# EAGLE design Growbox2 (EAGLE 7.7.0)
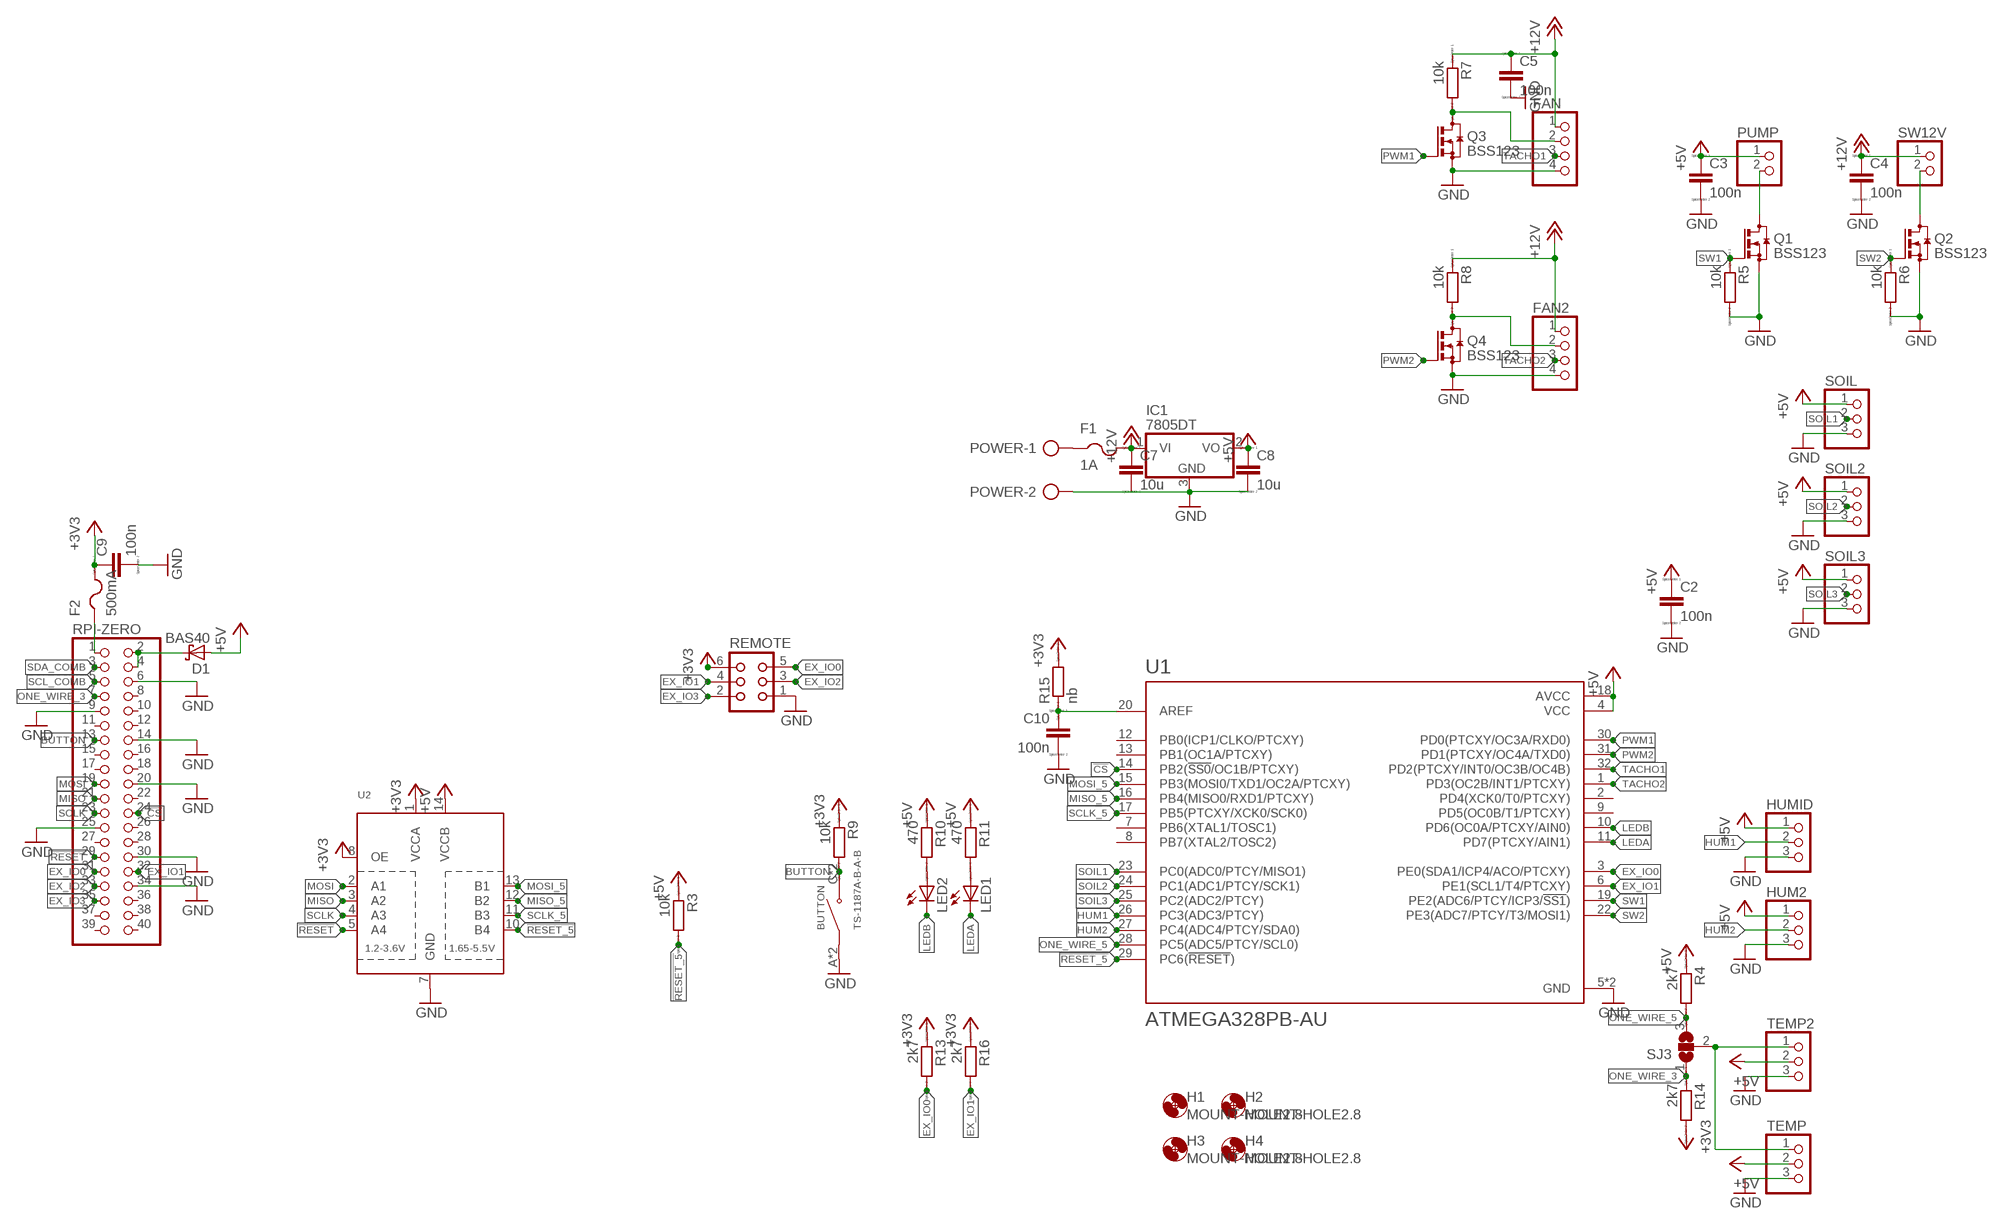
[diagram p0: schematic, sheet 1]

## Parts
BUTTON  TS-1187A-B-A-B  [SW_TS-1187A-B-A-B]
C2  100n  CC0603  [C0603]
C3  100n  CC0603  [C0603]
C4  100n  CC0603  [C0603]
C5  100n  CC0603  [C0603]
C7  10u  CC0603  [C0603]
C8  10u  CC0603  [C0603]
C9  100n  CC0603  [C0603]
C10  100n  CC0603  [C0603]
D1  BAS40  [SOT23]
F1  1A  PTCFUSE-1206  [R1206]
F2  500mA  PTCFUSE-1206  [R1206]
FAN  PINHD-1X4  [1X04]
FAN2  PINHD-1X4  [1X04]
H1  MOUNT-HOLE2.8  [2,8]
H2  MOUNT-HOLE2.8  [2,8]
H3  MOUNT-HOLE2.8  [2,8]
H4  MOUNT-HOLE2.8  [2,8]
HUM2  PINHD-1X3  [1X03]
HUMID  PINHD-1X3  [1X03]
IC1  7805DT  [TO252]
LED1  LEDCHIP-LED0603  [CHIP-LED0603]
LED2  LEDCHIP-LED0603  [CHIP-LED0603]
POWER  AK300/2  [AK300/2]
PUMP  PINHD-1X2  [1X02]
Q1  BSS123  [SOT23]
Q2  BSS123  [SOT23]
Q3  BSS123  [SOT23]
Q4  BSS123  [SOT23]
R3  10k  RR0603  [R0603]
R4  2k7  RR0603  [R0603]
R5  10k  RR0603  [R0603]
R6  10k  RR0603  [R0603]
R7  10k  RR0603  [R0603]
R8  10k  RR0603  [R0603]
R9  10k  RR0603  [R0603]
R10  470  RR0603  [R0603]
R11  470  RR0603  [R0603]
R13  2k7  RR0603  [R0603]
R14  2k7  RR0603  [R0603]
R15  nb  RR0603  [R0603]
R16  2k7  RR0603  [R0603]
REMOTE  CON06  [CON06]
RPI-ZERO  PINHD-2X20  [2X20]
SJ3  SJ2W  [SJ_2]
SOIL  PINHD-1X3  [1X03]
SOIL2  PINHD-1X3  [1X03]
SOIL3  PINHD-1X3  [1X03]
SW12V  PINHD-1X2  [1X02]
TEMP  PINHD-1X3  [1X03]
TEMP2  PINHD-1X3  [1X03]
U1  ATMEGA328PB-AU  [QFP80P900X900X120-32N]
U2  TXB0104PWR  [TSSOP14]

## Nets
!CS: RPI-ZERO.24 U1.14(PB2(!SS0!/OC1B/PTCXY))
!RESET: RPI-ZERO.29 U2.5(A4)
!RESET_5: R3.2 U1.29(PC6(!RESET!)) U2.10(B4)
+3V3: C9.1 F2.2 R9.1 R13.1 R14.2 R15.2 R16.1 REMOTE.6 U2.1(VCCA) U2.8(OE)
+5V: C2.1 C3.1 C8.1 D1.1(A) HUM2.1 HUMID.1 IC1.2(VO) PUMP.1 R3.1 R4.1 R10.1 R11.1 SOIL2.1 SOIL3.1 SOIL.1 TEMP2.2 TEMP.2 U1.4(VCC) U1.18(AVCC) U2.14(VCCB)
+12V [supply]: C4.1 C5.1 C7.1 F1.2 FAN2.1 FAN.1 IC1.1(VI) R7.1 R8.1 SW12V.1
AREF: C10.1 R15.1 U1.20(AREF)
BUTTON: BUTTON.C(NO) BUTTON.D(NO) R9.2 RPI-ZERO.13
EX_IO0: R13.2 REMOTE.5 RPI-ZERO.31 U1.3(PE0(SDA1/ICP4/ACO/PTCXY))
EX_IO1: R16.2 REMOTE.4 RPI-ZERO.32 U1.6(PE1(SCL1/T4/PTCXY))
EX_IO2: REMOTE.3 RPI-ZERO.33
EX_IO3: REMOTE.2 RPI-ZERO.35
GND [supply]: BUTTON.A(COM) BUTTON.B(COM) C2.2 C3.2 C4.2 C5.2 C7.2 C8.2 C9.2 C10.2 FAN2.4 FAN.4 HUM2.3 HUMID.3 IC1.3(GND) POWER.2 Q1.2(S) Q2.2(S) Q3.2(S) Q4.2(S) R5.2 R6.2 REMOTE.1 RPI-ZERO.6 RPI-ZERO.9 RPI-ZERO.14 RPI-ZERO.20 RPI-ZERO.25 RPI-ZERO.30 RPI-ZERO.34 SOIL2.3 SOIL3.3 SOIL.3 TEMP2.3 TEMP.3 U1.5(GND) U1.21(GND) U2.7(GND)
HUM1: HUMID.2 U1.26(PC3(ADC3/PTCY))
HUM2: HUM2.2 U1.27(PC4(ADC4/PTCY/SDA0))
LEDA: LED1.C U1.11(PD7(PTCXY/AIN1))
LEDB: LED2.C U1.10(PD6(OC0A/PTCXY/AIN0))
MISO: RPI-ZERO.21 U2.3(A2)
MISO_5: U1.16(PB4(MISO0/RXD1/PTCXY)) U2.12(B2)
MOSI: RPI-ZERO.19 U2.2(A1)
MOSI_5: U1.15(PB3(MOSI0/TXD1/OC2A/PTCXY)) U2.13(B1)
N$1: F1.1 POWER.1
N$4: F2.1 RPI-ZERO.1
N$9: LED2.A R10.2
N$10: D1.3(C) RPI-ZERO.2 RPI-ZERO.4
N$11: LED1.A R11.2
ONE_WIRE: SJ3.2 TEMP2.1 TEMP.1
ONE_WIRE_3: R14.1 RPI-ZERO.7 SJ3.1
ONE_WIRE_5: R4.2 SJ3.3 U1.28(PC5(ADC5/PTCY/SCL0))
PWM1: Q3.1(G) U1.30(PD0(PTCXY/OC3A/RXD0))
PWM1_SIG: FAN.2 Q3.3(D) R7.2
PWM2: Q4.1(G) U1.31(PD1(PTCXY/OC4A/TXD0))
PWM2_SIG: FAN2.2 Q4.3(D) R8.2
SCL_COMB: RPI-ZERO.5
SCLK: RPI-ZERO.23 U2.4(A3)
SCLK_5: U1.17(PB5(PTCXY/XCK0/SCK0)) U2.11(B3)
SDA_COMB: RPI-ZERO.3
SOIL1: SOIL.2 U1.23(PC0(ADC0/PTCY/MISO1))
SOIL2: SOIL2.2 U1.24(PC1(ADC1/PTCY/SCK1))
SOIL3: SOIL3.2 U1.25(PC2(ADC2/PTCY))
SW1: Q1.1(G) R5.1 U1.19(PE2(ADC6/PTCY/ICP3/!SS1!))
SW1_NEG: PUMP.2 Q1.3(D)
SW2: Q2.1(G) R6.1 U1.22(PE3(ADC7/PTCY/T3/MOSI1))
SW2_NEG: Q2.3(D) SW12V.2
TACHO1: FAN.3 U1.32(PD2(PTCXY/INT0/OC3B/OC4B))
TACHO2: FAN2.3 U1.1(PD3(OC2B/INT1/PTCXY))
Unconnected: RPI-ZERO.8 RPI-ZERO.10 RPI-ZERO.11 RPI-ZERO.12 RPI-ZERO.15 RPI-ZERO.16 RPI-ZERO.17 RPI-ZERO.18 RPI-ZERO.22 RPI-ZERO.26 RPI-ZERO.27 RPI-ZERO.28 RPI-ZERO.36 RPI-ZERO.37 RPI-ZERO.38 RPI-ZERO.39 RPI-ZERO.40 U1.2(PD4(XCK0/T0/PTCXY)) U1.7(PB6(XTAL1/TOSC1)) U1.8(PB7(XTAL2/TOSC2)) U1.9(PD5(OC0B/T1/PTCXY)) U1.12(PB0(ICP1/CLKO/PTCXY)) U1.13(PB1(OC1A/PTCXY))

## Library data of the parts
BUTTON = TS-1187A-B-A-B:TS-1187A-B-A-B: SPST 50mA @ 12VDC Top Actuated Round Button 160gf SMD Tactile Switches RoHS Check availability <https://pricing.snapeda.com/parts/TS-1187A-B-A-B/XKB%20Industrial%20Precision/view-part?ref=eda>; AVAILABILITY: Not in stock; CHECK_PRICES: https://www.snapeda.com/parts/TS-1187A-B-A-B/XKB+Industrial+Precision/view-part/?ref=eda; DESCRIPTION: TS-1187A-B-A-B XKB Connectivity; MF: XKB Industrial Precision; MP: TS-1187A-B-A-B; PACKAGE: Package; PRICE: None; SNAPEDA_LINK: https://www.snapeda.com/parts/TS-1187A-B-A-B/XKB+Industrial+Precision/view-part/?ref=snap
C2-C5 C7-C10 = eagle-ltspice:C: CAPACITOR, European symbol; SPICEMODEL: NONE; SPICEPREFIX: C
D1 = diode:BAS40: Silicon Schottky Diodes General-purpose diode for high-speed switching
F1 F2 = adafruit:PTCFUSE: PTC fuses, resettable thermistors
FAN FAN2 = pinhead:PINHD-1X4: PIN HEADER
H1-H4 = holes:MOUNT-HOLE: MOUNTING HOLE with drill center marker
HUM2 HUMID SOIL SOIL2 SOIL3 TEMP TEMP2 = pinhead:PINHD-1X3: PIN HEADER
IC1 = linear:78*: Positive VOLTAGE REGULATOR Source: http://cache.national.com/ds/LM/LM78L05.pdf http://www.fairchildsemi.com/ds/LM/LM7805.pdf
LED1 LED2 = adafruit:LED: LED OSRAM: - CHIPLED LG R971, LG N971, LY N971, LG Q971, LY Q971, LO R971, LY R971 LH N974, LH R974 LS Q976, LO Q976, LY Q976 LO Q996 - Hyper CHIPLED LW Q18S LB Q993, LB Q99A, LB R99A - SideLED LS A670, LO A670, LY A670, LG A670, LP A670 LB A673, LV A673, LT A673, LW A673 LH A674 LY A675 LS A676, LA A676, LO A676, LY A676, LW A676 LS A679, LY A679, LG A679 - Hyper Micro SIDELED® LS Y876, LA Y876, LO Y876, LY Y876 LT Y87S - SmartLED LW L88C, LW L88S LB L89C, LB L89S, LG L890 LS L89K, LO L89K, LY L89K LS L896, LA L896, LO L896, LY L896 - TOPLED LS T670, LO T670, LY T670, LG T670, LP T670 LSG T670, LSP T670, LSY T670, LOP T670, LYG T670 LG T671, LOG T671, LSG T671 LB T673, LV T673, LT T673, LW T673 LH T674 LS T676, LA T676, LO T676, LY T676, LB T676, LH T676, LSB T676, LW T676 LB T67C, LV T67C, LT T67C, LS T67K, LO T67K, LY T67K, LW E67C LS E67B, LA E67B, LO E67B, LY E67B, LB E67C, LV E67C, LT E67C LW T67C LS T679, LY T679, LG T679 LS T770, LO T770, LY T770, LG T770, LP T770 LB T773, LV T773, LT T773, LW T773 LH T774 LS E675, LA E675, LY E675, LS T675 LS T776, LA T776, LO T776, LY T776, LB T776 LHGB T686 LT T68C, LB T68C - Hyper Mini TOPLED® LB M676 - Mini TOPLED Santana® LG M470 LS M47K, LO M47K, LY M47K Source: http://www.osram.convergy.de/
POWER = con-ptr500:AK300/2: CONNECTOR; OC_FARNELL: unknown; OC_NEWARK: unknown
PUMP SW12V = pinhead:PINHD-1X2: PIN HEADER
Q1-Q4 = transistor-small-signal:BSS123: N-CHANNEL MOS FET
R3-R11 R13-R16 = eagle-ltspice:R: RESISTOR, European symbol; SPICEMODEL: NONE; SPICEPREFIX: R
REMOTE = con-harting:CON06: CONNECTOR; OC_FARNELL: unknown; OC_NEWARK: unknown
RPI-ZERO = adafruit:PINHD-2X20: PIN HEADER
SJ3 = jumper:SJ2W: SMD solder JUMPER
U1 = ATMEGA328PB-AU:ATMEGA328PB-AU: ATmega Series 20 MHz 32 KB Flash 2 KB SRAM 8-Bit Microcontroller - TQFP-32 Check availability <https://pricing.snapeda.com/parts/ATMEGA328PB-AU/Microchip/view-part?ref=eda>; AVAILABILITY: In Stock; CHECK_PRICES: https://www.snapeda.com/parts/ATMEGA328PB-AU/Microchip/view-part/?ref=eda; DESCRIPTION: AVR AVR® ATmega, Functional Safety (FuSa) Microcontroller IC 8-Bit 20MHz 32KB (16K x 16) FLASH 32-TQFP (7x7); MF: Microchip; MP: ATMEGA328PB-AU; PACKAGE: TQFP-32 Microchip; PRICE: None; PURCHASE-URL: https://www.snapeda.com/api/url_track_click_mouser/?unipart_id=424500&manufacturer=Microchip&part_name=ATMEGA328PB-AU&search_term=atmega328pb; SNAPEDA_LINK: https://www.snapeda.com/parts/ATMEGA328PB-AU/Microchip/view-part/?ref=snap
U2 = adafruit:TXB0104PWR: 4-Bit Bi-Directional Level Shifter 1.2V-3.6V (VCCA) to 1.65V-5.5V (VCCB) bi-directional level shifter with auto direction sensing. Max data rate - VCCA 1.8V: 20Mbps (50ns), VCCA 3.3V: 100Mbps (10ns) Digikey: 296-21929-1-ND

## Net classes
1 supply: width 0.406 mm

## Board
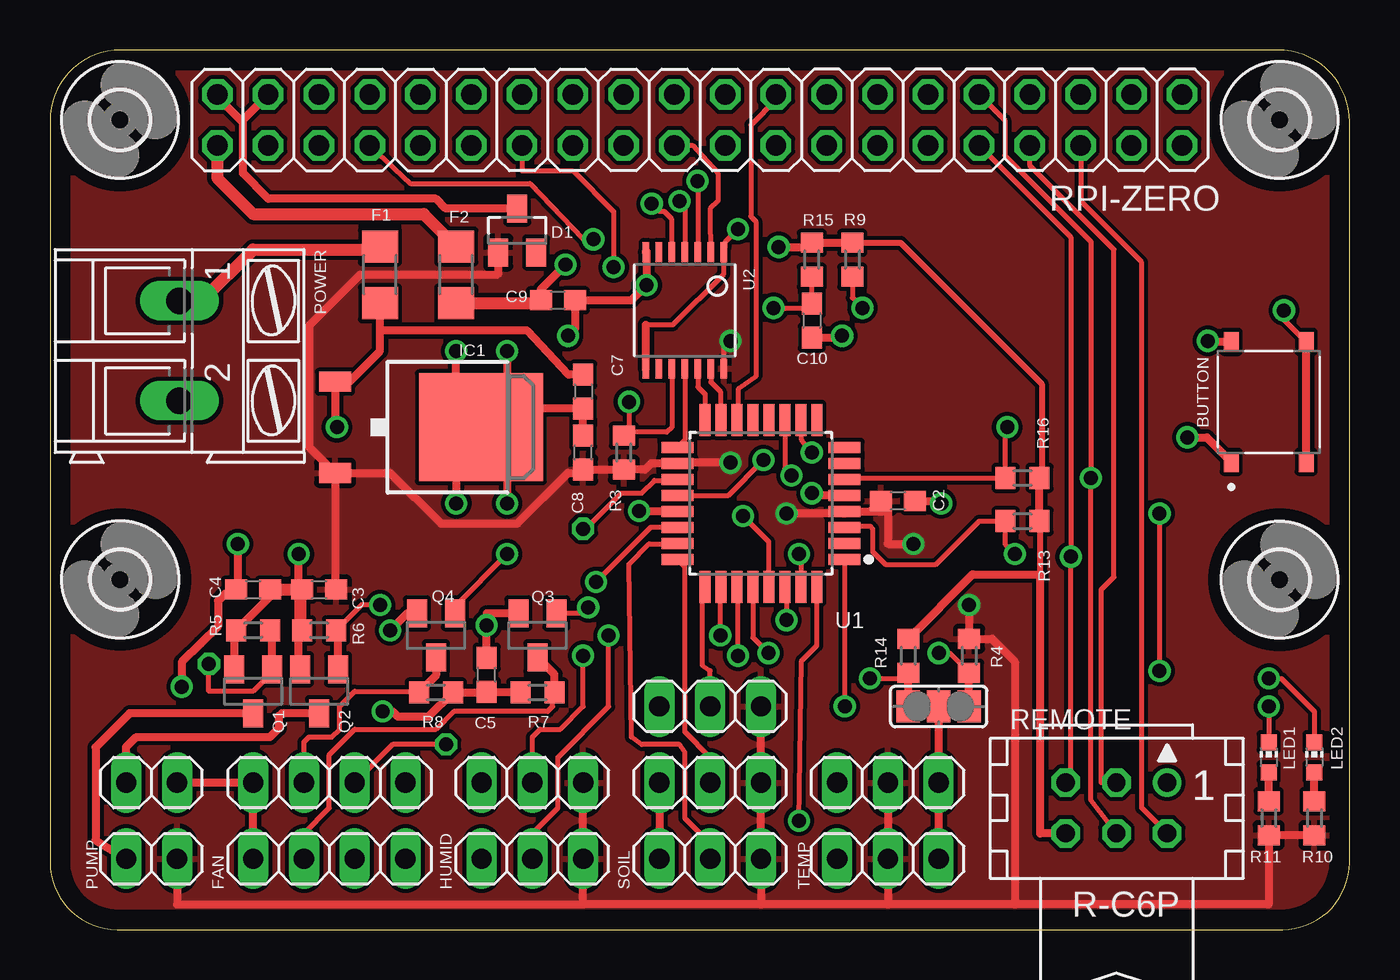
[diagram p1: board, top side]
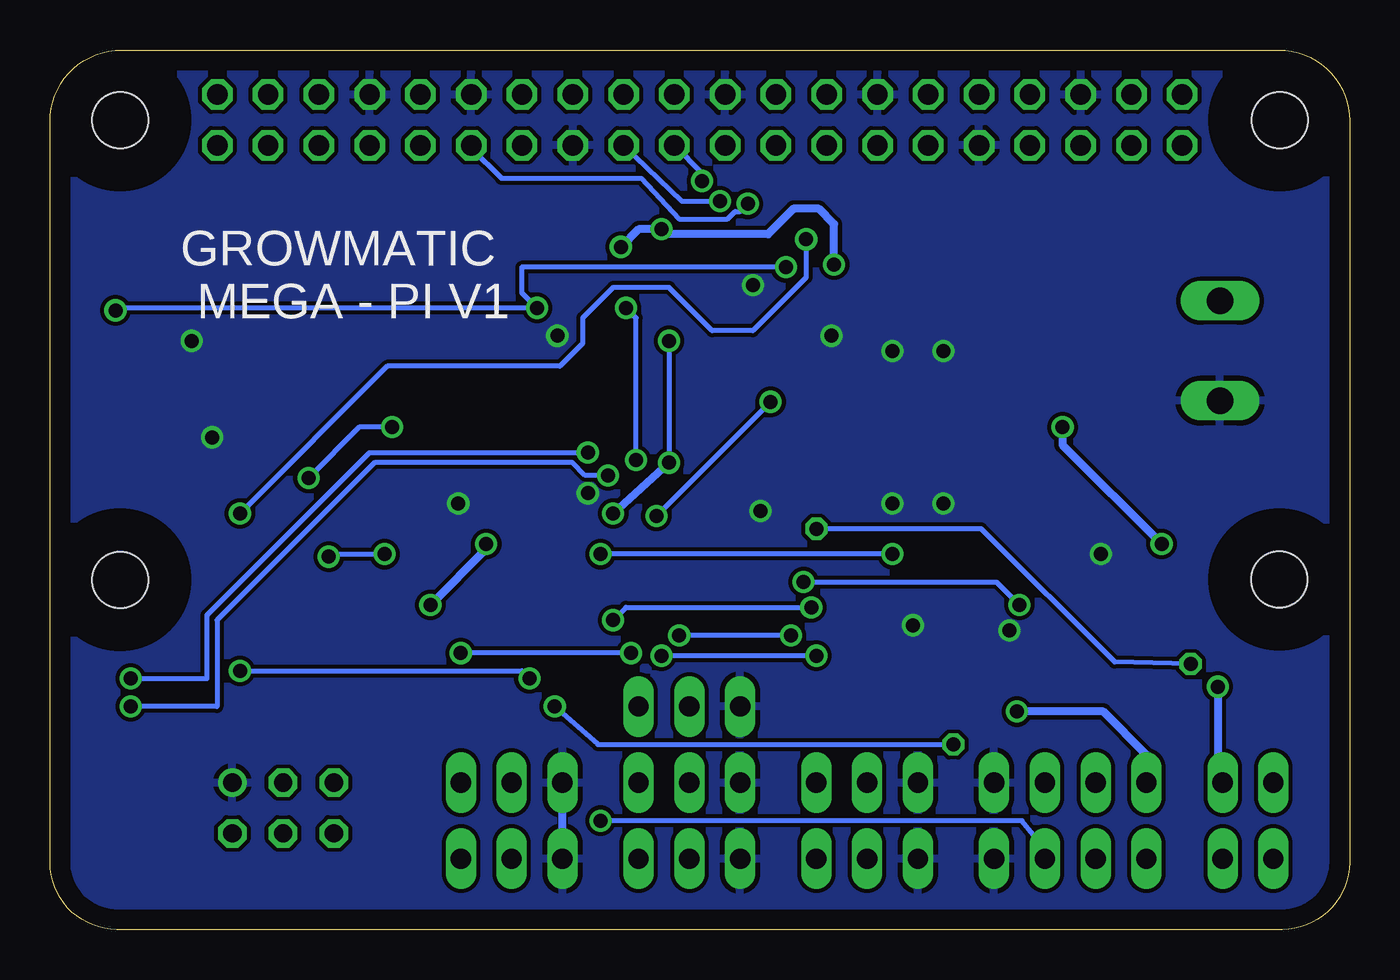
[diagram p2: board, bottom side, seen from below]

Size 65 x 44 mm. Coordinates in mm from the lower left corner, seen from the top.
Outline: 0,40.46 0,3.35 arc90 3.35,0 61.66,0 arc90 65,3.34 65,40.42 arc90 61.42,44 3.54,44 arc90 0,40.46
Copper layers (1*16): Top 0.035mm / dielectric 1.5mm / Bottom 0.035mm
Design rules "default": minimum track width 10mil, minimum drill 24mil, track to track 8mil, track to pad 8mil, pad to pad 8mil, via to via 8mil, smd to smd 8mil, copper to edge 40mil, drill to drill 8mil, minimum pad ring 10mil, minimum via ring 8mil, stop-mask expansion 4mil, vias tented up to drill 0mil, thermal gap 10mil

### Footprints (pad centres in the part's own frame; a part is rotated, then mirrored left to right if it is on the bottom)
SW_TS-1187A-B-A-B = smd 1 x 0.75: A -3,1.875; B 3,1.875; C -3,-1.875; D 3,-1.875
C0603 = smd 1.1 x 1: 1 -0.85,0; 2 0.85,0
SOT23 = smd 1 x 1.4: 1 -0.95,-1.1; 2 0.95,-1.1; 3 0,1.1
R1206 = smd 1.6 x 1.803: 1 -1.422,0; 2 1.422,0
1X04 = drill 1.016 long: 1 -3.81,0; 2 -1.27,0; 3 1.27,0; 4 3.81,0
2,8 = hole 2.8: 0,0
1X03 = drill 1.016 long: 1 -2.54,0; 2 0,0; 3 2.54,0
TO252 = smd 1 x 1.6: 1 -2.28,-4.8; 2 2.28,-4.8 | smd 5.4 x 6.2: 3 0,2.5
CHIP-LED0603 = smd 0.8 x 0.8: A 0,-0.75; C 0,0.75
AK300/2 = drill 1.321 long: 1 -2.515,0; 2 2.489,0
1X02 = drill 1.016 long: 1 -1.27,0; 2 1.27,0
R0603 = smd 1 x 1.1: 1 -0.85,0; 2 0.85,0
CON06 = drill 0.914: 1 -2.54,-1.27 | drill 0.914 octagon: 2 -2.54,1.27; 3 0,-1.27; 4 0,1.27; 5 2.54,-1.27; 6 2.54,1.27
2X20 = drill 1.016 octagon: 1 -24.13,-1.27; 2 -24.13,1.27; 3 -21.59,-1.27; 4 -21.59,1.27; 5 -19.05,-1.27; 6 -19.05,1.27; 7 -16.51,-1.27; 8 -16.51,1.27; 9 -13.97,-1.27; 10 -13.97,1.27; 11 -11.43,-1.27; 12 -11.43,1.27; 13 -8.89,-1.27; 14 -8.89,1.27; 15 -6.35,-1.27; 16 -6.35,1.27; 17 -3.81,-1.27; 18 -3.81,1.27; 19 -1.27,-1.27; 20 -1.27,1.27; 21 1.27,-1.27; 22 1.27,1.27; 23 3.81,-1.27; 24 3.81,1.27; 25 6.35,-1.27; 26 6.35,1.27; 27 8.89,-1.27; 28 8.89,1.27; 29 11.43,-1.27; 30 11.43,1.27; 31 13.97,-1.27; 32 13.97,1.27; 33 16.51,-1.27; 34 16.51,1.27; 35 19.05,-1.27; 36 19.05,1.27; 37 21.59,-1.27; 38 21.59,1.27; 39 24.13,-1.27; 40 24.13,1.27
SJ_2 = smd 1.168 x 1.6: 1 -1.524,0; 2 0,0; 3 1.524,0
QFP80P900X900X120-32N = smd 1.6 x 0.55: 1 -4.18,2.8; 2 -4.18,2; 3 -4.18,1.2; 4 -4.18,0.4; 5 -4.18,-0.4; 6 -4.18,-1.2; 7 -4.18,-2; 8 -4.18,-2.8; 17 4.18,-2.8; 18 4.18,-2; 19 4.18,-1.2; 20 4.18,-0.4; 21 4.18,0.4; 22 4.18,1.2; 23 4.18,2; 24 4.18,2.8 | smd 0.55 x 1.6: 9 -2.8,-4.18; 10 -2,-4.18; 11 -1.2,-4.18; 12 -0.4,-4.18; 13 0.4,-4.18; 14 1.2,-4.18; 15 2,-4.18; 16 2.8,-4.18; 25 2.8,4.18; 26 2,4.18; 27 1.2,4.18; 28 0.4,4.18; 29 -0.4,4.18; 30 -1.2,4.18; 31 -2,4.18; 32 -2.8,4.18
TSSOP14 = smd 0.305 x 0.991: 1 -1.95,-2.918; 2 -1.3,-2.918; 3 -0.65,-2.918; 4 0,-2.918; 5 0.65,-2.918; 6 1.3,-2.918; 7 1.95,-2.918; 8 1.95,2.918; 9 1.3,2.918; 10 0.65,2.918; 11 0,2.918; 12 -0.65,2.918; 13 -1.3,2.918; 14 -1.95,2.918

### Placement (x,y rotation side)
BUTTON  60.96,26.4 90 top
C2  42.42,21.45 0 top
C3  13.46,17 180 top
C4  10.16,17 0 top
C5  21.84,12.75 90 top
C7  26.67,26.91 270 top
C8  26.67,23.86 90 top
C9  25.4,31.48 0 top
C10  38.1,30.46 270 top
D1  23.37,34.97 0 top
F1  16.51,32.75 270 top
F2  20.32,32.75 270 top
FAN  13.97,3.54 0 top
FAN2  13.97,7.35 0 top
H1  3.51,17.51 0 top
H2  3.5,40.5 0 top
H3  61.5,17.5 0 top
H4  61.5,40.5 0 top
HUM2  24.13,7.35 180 top
HUMID  24.13,3.54 180 top
IC1  19.05,25.13 270 top
LED1  60.96,8.62 0 top
LED2  63.25,8.62 0 top
POWER  6.48,28.94 270 top
PUMP  5.08,3.54 180 top
Q1  10.16,11.92 180 top
Q2  13.46,11.92 180 top
Q3  24.38,14.72 180 top
Q4  19.3,14.72 180 top
R3  28.7,23.86 90 top
R4  45.97,13.7 270 top
R5  10.16,14.97 180 top
R6  13.46,14.97 180 top
R7  24.38,11.86 0 top
R8  19.3,11.86 180 top
R9  40.13,33.51 270 top
R10  63.25,5.57 90 top
R11  60.96,5.57 90 top
R13  48.64,20.43 180 top
R14  42.93,13.7 90 top
R15  38.1,33.51 90 top
R16  48.64,22.59 180 top
REMOTE  53.34,6.08 180 top
RPI-ZERO  32.5,40.5 0 top
SJ3  44.45,11.16 0 top
SOIL  33.02,3.54 180 top
SOIL2  33.02,7.35 180 top
SOIL3  33.02,11.16 180 top
SW12V  5.08,7.35 180 top
TEMP  41.91,3.54 180 top
TEMP2  41.91,7.35 180 top
U1  35.56,21.32 180 top
U2  31.75,30.97 180 top

### Tracks (layer width: path | path; a pad name or v marks a point on that pad's centre or on a via)
!CS
  Top 0.254: RPI-ZERO.24 36.31,41.5 35.05,40.24 35.05,35.67 35.31,35.42 35.31,27.67 34.42,27.04 34.42,25.56 U1.14
!RESET  (via drill 0.7)
  Top 0.254: U2.5 31.1,35.53 30.73,35.92 30.48,35.92 v30.1,36.31
  Bottom 0.254: RPI-ZERO.29 43.93,39.09 42.42,37.58 35.43,37.58 33.53,35.54 31.11,35.54 30.73,35.92 30.48,35.92 v30.1,36.31
!RESET_5  (via drill 0.7)
  Top 0.254: U2.10 31.1,25.11 30.86,24.88 28.87,24.88 R3.2 28.96,24.96 v28.96,26.4 | U1.29 35.96,19.4 v34.67,20.68
  Bottom 0.254: v34.67,20.68 v28.96,26.4
+3V3  (via drill 0.7)
  Top 0.254: U2.8 29.8,30.16 | v34.42,35.04 33.78,34.4 33.78,34.15 33.7,34.23 U2.1 33.7,32.8 31.16,30.25 29.8,30.25
  Top 0.305: R9.1 42.54,34.36 49.6,27.3 49.6,22.7 R16.1 | 49.53,17.76 49.53,20.39 R13.1
  Top 0.406: R9.1 R15.2 37.88,34.15 v36.45,34.15 | R13.1 R16.1 | U2.8 29.8,30.25 | REMOTE.6 49.53,4.81 49.53,17.76 46.14,17.76 R14.2 | C9.1 24.55,32.03 v25.78,33.26
  Top 0.61: F2.2 24.4,31.33 C9.1
  Bottom 0.406: v25.78,33.26 25.78,35.29 26.54,36.05 27.81,36.05 29.08,34.78 34.16,34.78 v34.42,35.04 35.56,35.04 v36.45,34.15
+5V  (via drill 0.7)
  Top 0.254: U2.14 33.7,29.15 v34.04,29.45
  Top 0.406: R10.1 R11.1 60.96,1.25 48.26,1.25 | IC1.2 17.01,22.85 19.56,20.3 23.37,20.3 25.91,22.84 26.5,22.84 C8.1 R3.1 29.76,23.01 30.07,23.32 U1.18 arc-90 31.41,23.35 v34.04,23.35 | HUM2.1 HUMID.1 26.67,1.25 | SOIL3.1 SOIL2.1 SOIL.1 35.56,1.25 | PUMP.1 6.35,1.25 26.67,1.25 | 41.91,1.25 TEMP.2 TEMP2.2 | 41.91,1.25 35.56,1.25 | 35.56,1.25 26.67,1.25 | 48.26,1.25 41.91,1.25 | IC1.2 12.95,24.15 12.95,30.21 15.49,32.75 22.35,32.75 22.42,32.82 D1.1 | 41.04,20.92 U1.4 39.72,20.81 v36.83,20.81 | 41.04,20.92 C2.1 | 41.04,20.92 41.91,20.92 41.91,19.29 v43.18,19.29 | v45.97,16.24 R4.1 47.12,14.55 48.26,13.41 48.26,1.25 | IC1.2 14.25,17.06 C3.1
  Bottom 0.254: v34.04,29.45 v34.04,23.35
  Bottom 0.406: v43.18,19.29 43.18,19.03 v45.97,16.24 | v36.83,20.81 v34.04,23.35
  pour Top: -2,45 -2,-1 66,-1 66,45
+12V  (via drill 0.7)
  Top 0.406: R7.1 23.57,11.9 C5.1 21.63,11.86 R8.1 18.95,10.65 17.4,10.65 17.14,10.91 v16.64,10.91 | FAN.1 FAN2.1 SW12V.1 | v6.6,12.15 6.6,13.38 7.53,14.31 7.54,14.31 8.4,15.16 8.4,16.44 8.76,16.8 9.28,16.8 C4.1 9.4,17.09 v9.4,19.29 | 16.51,29.96 16.51,28.94 14.98,27.41 IC1.1 14.25,25.23 v14.35,25.13 | 16.51,29.96 F1.2 | C7.1 25.95,27.76 23.88,29.96 16.51,29.96
  Bottom 0.406: v14.35,25.13 14.35,24.24 v9.4,19.29 | FAN2.1 10.16,8.75 12.32,10.91 v16.64,10.91 | v6.6,12.15 6.6,7.6 SW12V.1
AREF  (via drill 0.7)
  Top 0.254: R15.1 C10.1 37.88,31.1 v36.2,31.1 | U1.20 33.93,21.72 v35.69,23.48
  Bottom 0.254: v35.69,23.48 35.69,30.59 v36.2,31.1
BUTTON  (via drill 0.7)
  Top 0.254: R9.2 40.13,31.61 v40.64,31.1 | v61.72,30.97 61.72,30.51 BUTTON.D | RPI-ZERO.13 23.61,37.96 26.16,37.96 28.19,35.92 v28.19,33.13
  Top 0.406: BUTTON.C BUTTON.D
  Bottom 0.254: v61.72,30.97 61.59,31.1 v40.64,31.1 41.4,31.86 41.4,33.13 v28.19,33.13
EX_IO0  (via drill 0.7)
  Top 0.254: RPI-ZERO.31 51.05,34.65 v51.05,18.65 51.05,7.6 REMOTE.5 | U1.3 39.8,20.18 41.02,20.18 41.15,20.05 41.15,18.91 41.78,18.27 44.32,18.27 46.48,20.43 R13.2 47.79,19.25 v48.26,18.78
  Bottom 0.254: v51.05,18.65 50.93,18.78 v48.26,18.78
EX_IO1  (via drill 0.7)
  Top 0.254: RPI-ZERO.32 47.75,40.5 47.75,38.72 52.07,34.4 v52.07,22.59 52.07,6.46 REMOTE.4 | U1.6 39.81,22.59 R16.2 47.79,25.04 v47.88,25.13
  Bottom 0.254: v47.88,25.13 49.53,25.13 v52.07,22.59
EX_IO2
  Top 0.254: REMOTE.3 52.58,7.35 52.58,17 53.21,17.64 53.21,34.02 49.02,38.21 49.02,39.22 RPI-ZERO.33
EX_IO3
  Top 0.254: RPI-ZERO.35 51.55,36.45 54.61,33.38 54.61,6.08 REMOTE.2
GND  (via drill 0.7)
  Top 0.406: IC1.3 20.83,25.13 | 20.83,25.13 20.32,25.13 | 20.32,25.13 v20.32,28.94 | 20.83,25.13 20.83,26.91 22.86,26.91 v22.86,28.94 22.86,25.89 | 20.32,25.13 v20.32,21.32 | 22.86,25.89 v22.86,21.32 | C5.2 v21.84,15.22 21.84,15.82 Q3.2 | 12.45,14.97 R6.2 C3.2 | Q2.2 12.45,13.02 12.45,14.97 | 12.45,14.97 v12.45,18.78 | C4.2 11.01,16.67 R5.2 9.21,14.81 | 56.81,24.71 v56.9,24.62 57.86,24.62 BUTTON.A | C10.2 39.54,29.61 v39.62,29.7 | C8.2 C7.2 23.71,26.06 23.62,26.15 23.11,26.15 22.86,25.89 | BUTTON.B 57.96,29.4 v57.91,29.45 | v25.91,29.7 26.25,30.04 C9.2 29.08,31.48 v29.84,32.24 29.85,33.89 U2.7 | Q4.2 17.86,15.82 v17.02,14.97 | C2.2 44.45,21.45 v44.58,21.32 | 31.4,20.94 U1.21 31.36,20.94 v29.46,20.94 | U1.5 38.21,21.72 v38.1,21.83 | 9.21,14.87 9.21,14.81 | 9.21,14.81 Q1.2 | SOIL2.3 SOIL.3
  Top 0.61: C4.2 C3.2
  Bottom 0.406: TEMP.3 TEMP2.3
  pour Bottom: 65.02,-0.02 -0.6,-0.72 -0.6,0.5 0,44.18 65.02,44.18
HUM1  (via drill 0.7)
  Top 0.254: HUMID.2 24.13,4.81 25.4,6.08 25.4,8.62 27.94,11.16 v27.94,14.72 | v33.53,14.72 33.53,17.11 U1.26
  Bottom 0.254: v27.94,14.72 v33.53,14.72
HUM2  (via drill 0.7)
  Top 0.254: HUM2.2 24.13,9.64 24.51,10.02 25.53,10.02 26.67,11.16 v26.67,13.7 | v34.42,13.7 34.42,17.07 U1.27
  Bottom 0.254: v26.67,13.7 v34.42,13.7
LEDA  (via drill 0.7)
  Top 0.254: U1.11 36.76,23.04 v37.08,22.72 | v60.96,11.16 LED1.C
  Bottom 0.254: v37.08,22.72 38.23,22.72 38.86,23.35 48.77,23.35 56.64,15.48 56.64,11.16 v60.96,11.16
LEDB  (via drill 0.7)
  Top 0.254: v38.1,23.86 37.59,24.5 37.59,25.47 U1.10 | v60.96,12.56 61.59,12.56 63.25,10.91 LED2.C
  Bottom 0.254: v38.1,23.86 49.02,23.86 57.15,15.73 57.15,12.56 v60.96,12.56
MISO  (via drill 0.7)
  Top 0.254: v32.38,37.45 32.4,36.93 U2.3
  Bottom 0.254: RPI-ZERO.21 32.38,37.84 v32.38,37.45
MISO_5
  Top 0.254: U2.12 32.4,27.15 32.77,26.78 U1.16
MOSI
  Top 0.254: RPI-ZERO.19 32.13,39.23 33.4,37.83 33.4,36.43 33.02,36.05 33.02,35.06 U2.2
MOSI_5
  Top 0.254: U2.13 33.05,27.39 33.53,26.91 33.53,25.53 U1.15
N$1
  Top 0.61: POWER.1 7.59,31.45 10.16,34.02 16.36,34.02 F1.1
N$4
  Top 0.61: RPI-ZERO.1 8.37,37.59 10.16,35.8 18.69,35.8 F2.1
N$9
  Top 0.406: R10.2 LED2.A
N$10
  Top 0.406: D1.3 19.79,36.07 19.3,36.56 10.92,36.56 9.65,37.83 9.65,40.37 | 9.65,40.37 9.65,40.51 RPI-ZERO.4 | RPI-ZERO.2 8.37,41.65 9.65,40.37
N$11
  Top 0.406: R11.2 LED1.A
ONE_WIRE
  Top 0.406: TEMP.1 TEMP2.1 SJ3.2
ONE_WIRE_3  (via drill 0.7)
  Top 0.254: RPI-ZERO.7 18.02,37.32 24,37.32 26.67,34.53 v27.18,34.53 | v55.5,20.81 v55.5,12.94 | v41.02,12.56 42.63,12.56 R14.1
  Top 0.406: SJ3.1 R14.1
  Bottom 0.254: v27.18,34.53 27.18,32.62 29.84,29.96 31.88,29.96 34.04,32.12 36.83,32.12 38.35,30.59 38.35,29.32 39.5,28.18 48.13,28.18 v55.5,20.81 | v55.5,12.94 41.4,12.94 v41.02,12.56
ONE_WIRE_5  (via drill 0.7)
  Top 0.254: U1.28 35.16,14.61 v35.94,13.83 | v44.45,13.83 45,13.83 R4.2
  Top 0.406: SJ3.3 R4.2
  Bottom 0.254: v35.94,13.83 v44.45,13.83
PWM1  (via drill 0.7)
  Top 0.254: U1.30 36.83,17.07 v36.83,15.48 | v26.92,16.11 26.63,15.82 Q3.1
  Bottom 0.254: v36.83,15.48 36.2,16.11 v26.92,16.11
PWM1_SIG
  Top 0.254: FAN.2 12.7,4.81 13.97,6.08 13.97,8.75 15.24,10.02 19.3,10.02 20.19,10.91 24.89,10.91 25.15,11.16 25.15,11.77 R7.2
  Top 0.406: R7.2 25.23,12.77 Q3.3
PWM2  (via drill 0.7)
  Top 0.254: Q4.1 20.25,16.17 v22.86,18.78 | v37.47,18.78 37.56,18.68 U1.31
  Bottom 0.254: v22.86,18.78 v37.47,18.78
PWM2_SIG
  Top 0.254: FAN2.2 12.7,9.38 12.95,9.64 14.1,9.64 14.48,10.02 14.48,11.16 15.24,11.92 18.39,11.92 R8.2
  Top 0.406: Q4.3 19.3,12.71 R8.2
SCLK  (via drill 0.7)
  Top 0.254: v31.5,36.43 31.75,36.05 U2.4
  Bottom 0.254: RPI-ZERO.23 33.39,36.43 v31.5,36.43
SCLK_5
  Top 0.254: U2.11 31.75,24.49 U1.17
SOIL1
  Top 0.254: SOIL.2 33.02,4.3 31.75,5.57 31.75,8.87 31.5,9.26 29.59,9.26 29.08,9.64 28.96,18.27 29.97,19.29 31.35,19.29 U1.23
SOIL2
  Top 0.254: SOIL2.2 33.02,8.62 31.75,9.89 31.75,18.15 U1.24
SOIL3
  Top 0.254: SOIL3.2 33.02,12.94 32.64,13.19 32.64,17.13 U1.25
SW1  (via drill 0.7)
  Top 0.254: 11.11,14.87 11.11,12.87 10.16,11.92 7.95,11.92 v7.95,13.28 | v26.67,20.05 26.8,20.05 28.57,21.83 29.59,21.83 30.23,22.46 31.32,22.46 U1.19
  Top 0.406: Q1.1 11.11,14.87 R5.1
  Bottom 0.254: v7.95,13.28 11.75,13.38 18.41,20.05 v26.67,20.05
SW1_NEG
  Top 0.406: Q1.3 3.98,10.82 2.28,9.12 2.28,4.47 PUMP.2
SW2  (via drill 0.7)
  Top 0.254: U1.22 30.04,20.12 v27.3,17.38 | v16.51,16.24 15.58,16.24 R6.1
  Top 0.406: Q2.1 14.41,14.87 R6.1
  Bottom 0.254: v27.3,17.38 17.65,17.38 v16.51,16.24
SW2_NEG
  Top 0.406: SW12V.2 3.81,9.13 4.32,9.64 11.01,9.64 11.43,10.06 11.43,10.65 11.6,10.82 Q2.3
TACHO1  (via drill 0.7)
  Top 0.254: v37.47,5.45 37.59,13.45 38.35,14.21 U1.32
  Bottom 0.254: FAN.3 15.24,4.05 16.38,5.45 v37.47,5.45
TACHO2  (via drill 0.7)
  Top 0.254: v39.75,11.16 U1.1 | v19.81,9.26 17.14,9.26 FAN2.3
  Bottom 0.254: v39.75,11.16 37.59,9.26 v19.81,9.26

### Text on the board
bNames: GROWMATIC / MEGA - PI V1